# EAGLE schematic Rudder - Prototype 1 (EAGLE 7.5.0)
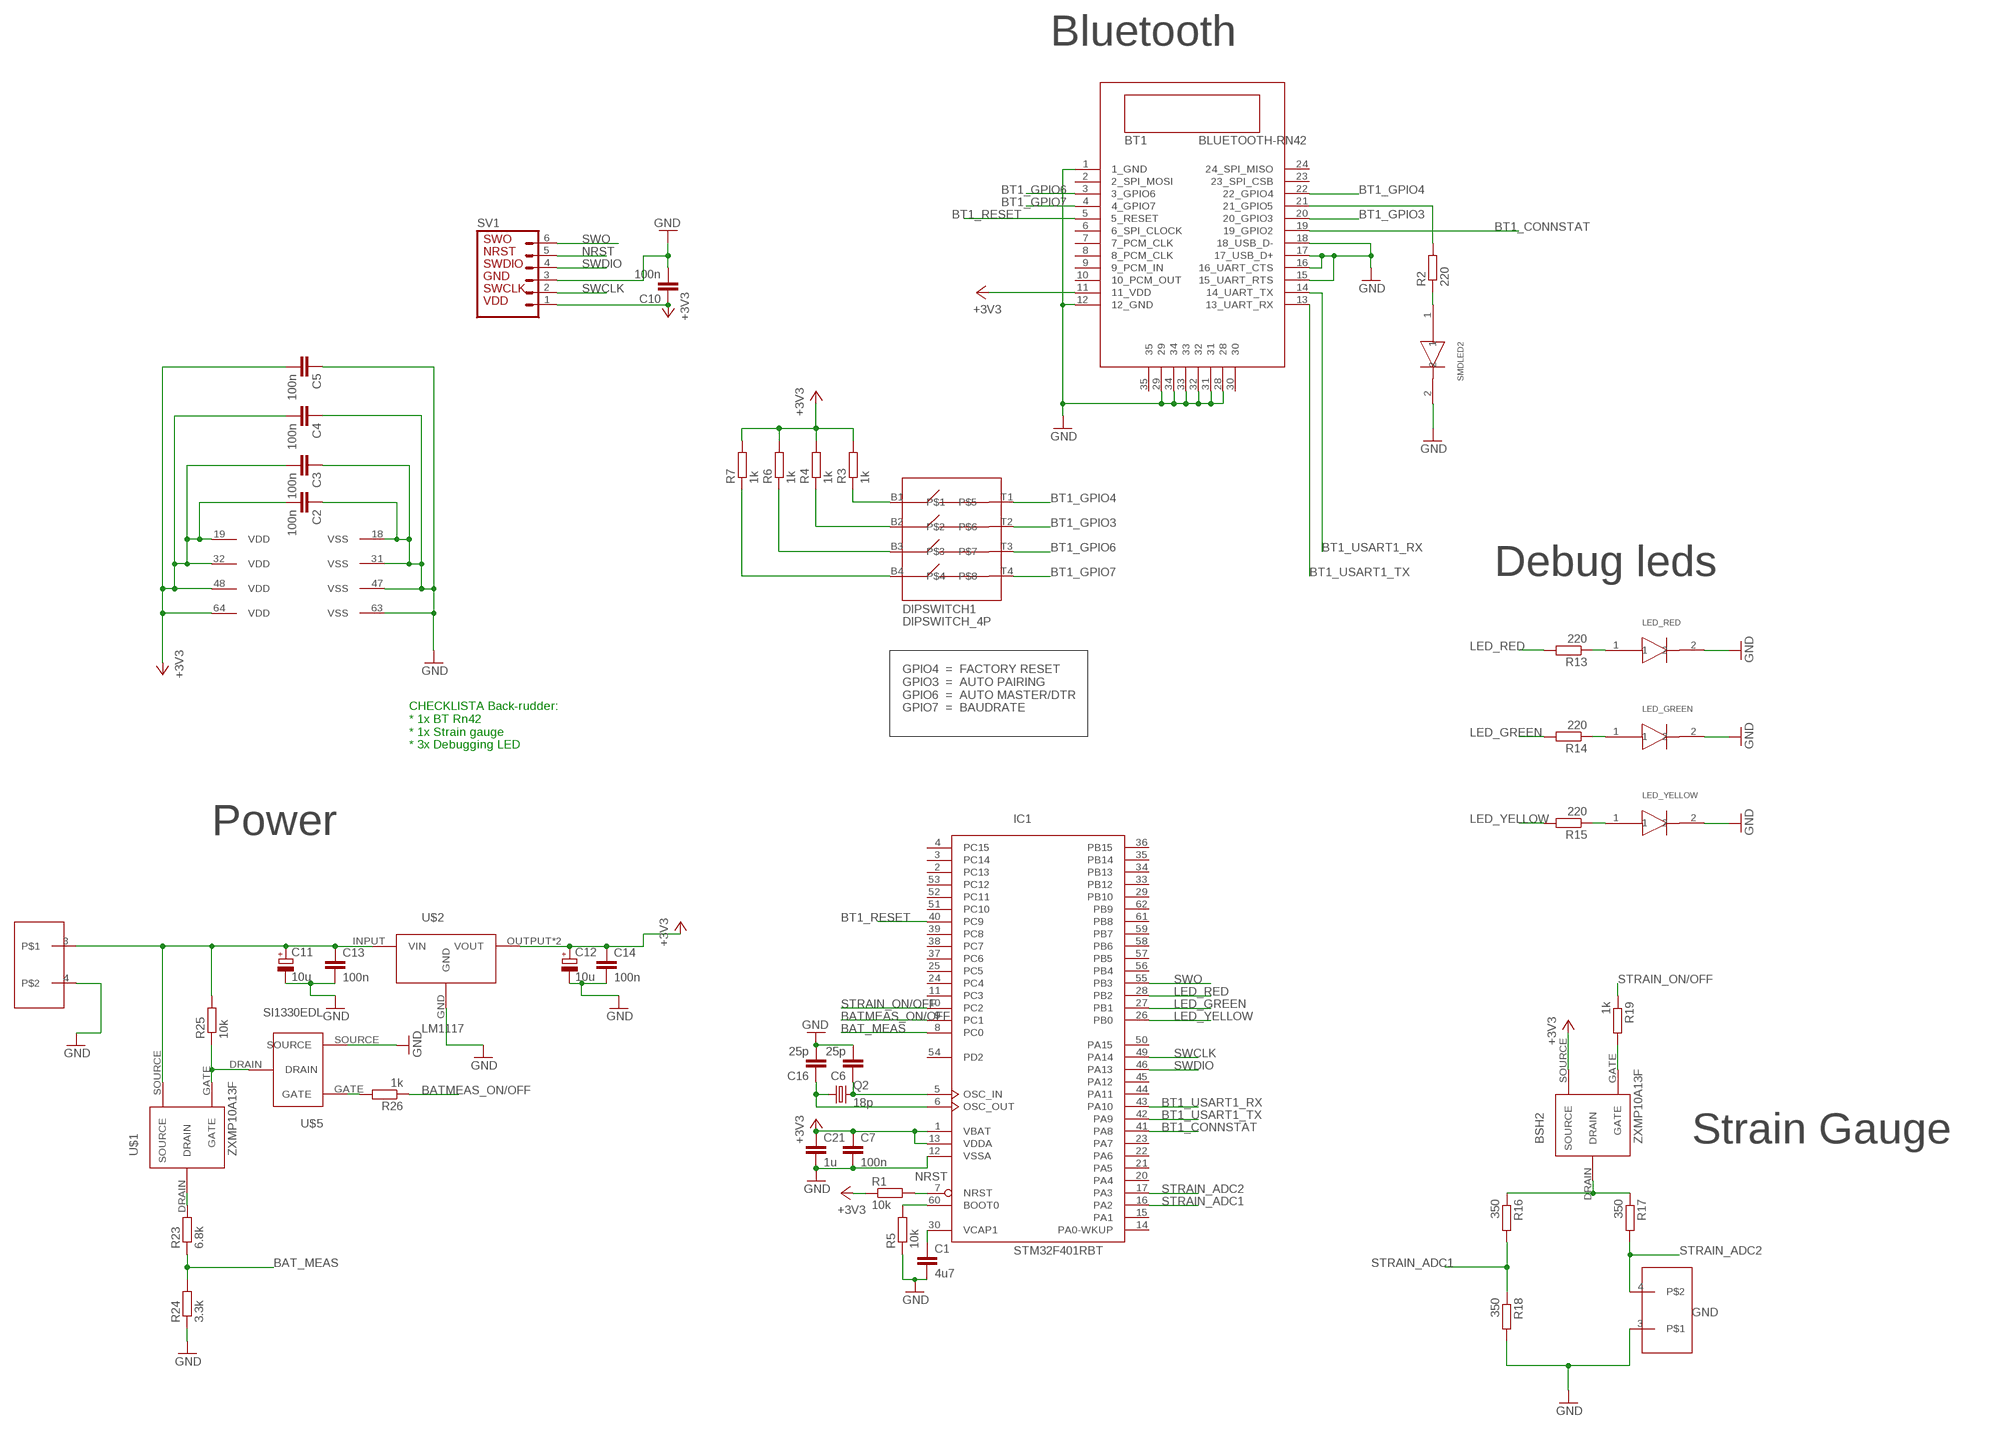
[diagram p0: schematic, sheet 1]

## Parts
BSH2  ZXMP10A13F  [P-CHANNEL]
BT1  BLUETOOTH-RN42  [RN42]
C1  4u7  C-EUC0805  [C0805]
C2  100n  C-EUC0805  [C0805]
C3  100n  C-EUC0805  [C0805]
C4  100n  C-EUC0805  [C0805]
C5  100n  C-EUC0805  [C0805]
C6  25p  C-EUC0805  [C0805]
C7  100n  C-EUC0805  [C0805]
C10  100n  C-EUC0805  [C0805]
C11  10u  CPOL-EU153CLV-0505  [153CLV-0505]
C12  10u  CPOL-EU153CLV-0505  [153CLV-0505]
C13  100n  C-EUC0805  [C0805]
C14  100n  C-EUC0805  [C0805]
C16  25p  C-EUC0805  [C0805]
C21  1u  C-EUC0805  [C0805]
DIPSWITCH1  DIPSWITCH_4P  [DIPSWITCH4P]
IC1  STM32F401RBT  [LQFP64]
LED_GREEN  SMD_LED  [SMD_LED_CUSTOM]
LED_RED  SMD_LED  [SMD_LED_CUSTOM]
LED_YELLOW  SMD_LED  [SMD_LED_CUSTOM]
Q2  18p  CRYSTALHC49UP  [HC49UP]
R1  10k  R-EU_R0805  [R0805]
R2  220  R-EU_R0805  [R0805]
R3  1k  R-EU_R0805  [R0805]
R4  1k  R-EU_R0805  [R0805]
R5  10k  R-EU_R0805  [R0805]
R6  1k  R-EU_R0805  [R0805]
R7  1k  R-EU_R0805  [R0805]
R13  220  R-EU_R0805  [R0805]
R14  220  R-EU_R0805  [R0805]
R15  220  R-EU_R0805  [R0805]
R16  350  R-EU_R0805  [R0805]
R17  350  R-EU_R0805  [R0805]
R18  350  R-EU_R0805  [R0805]
R19  1k  R-EU_R0805  [R0805]
R23  6.8k  R-EU_R0805  [R0805]
R24  3.3k  R-EU_R0805  [R0805]
R25  10k  R-EU_R0805  [R0805]
R26  1k  R-EU_R0805  [R0805]
SKRUVPLINT_2P3  SKRUVPLINT_2P  [SKRUVPLINT_2P]
SKRUVPLINT_2P5  SKRUVPLINT_2P  [SKRUVPLINT_2P]
SMDLED2  SMD_LED  [SMD_LED_CUSTOM]
SV1  MA06-1  [MA06-1]
U$1  ZXMP10A13F  [P-CHANNEL]
U$2  LM1117  [SOT-223]
U$5  SI1330EDL  [SOT-323]

## Nets
+3V3: BSH2.SOURCE BT1.11(11_VDD) C2.2 C3.2 C4.2 C5.2 C7.1 C10.1 C12.+ C14.1 C21.1 IC1.1(VBAT) IC1.13(VDDA) IC1.19(VDD) IC1.32(VDD) IC1.48(VDD) IC1.64(VDD) R1.1 R3.2 R4.2 R6.2 R7.2 SV1.1 U$2.OUTPUT(VOUT) U$2.VOUT
BAT_MEAS: IC1.8(PC0) R23.1 R24.2
BATMEAS_ON/OFF: IC1.9(PC1) R26.1
BT1_CONNSTAT: BT1.19(19_GPIO2) IC1.41(PA8)
BT1_GPIO3: BT1.20(20_GPIO3) DIPSWITCH1.T2
BT1_GPIO4: BT1.22(22_GPIO4) DIPSWITCH1.T1
BT1_GPIO6: BT1.3(3_GPIO6) DIPSWITCH1.T3
BT1_GPIO7: BT1.4(4_GPIO7) DIPSWITCH1.T4
BT1_RESET: BT1.5(5_RESET) IC1.40(PC9)
BT1_USART1_RX: BT1.14(14_UART_TX) IC1.43(PA10)
BT1_USART1_TX: BT1.13(13_UART_RX) IC1.42(PA9)
GND: BT1.1(1_GND) BT1.12(12_GND) BT1.15(15_UART_RTS) BT1.16(16_UART_CTS) BT1.17(17_USB_D+) BT1.18(18_USB_D-) BT1.28 BT1.29 BT1.31 BT1.32 BT1.33 BT1.34 C1.2 C2.1 C3.1 C4.1 C5.1 C6.2 C7.2 C10.2 C11.- C12.- C13.2 C14.2 C16.2 C21.2 IC1.12(VSSA) IC1.18(VSS) IC1.31(VSS) IC1.47(VSS) IC1.63(VSS) LED_GREEN.2 LED_RED.2 LED_YELLOW.2 R5.1 R18.2 R24.1 SKRUVPLINT_2P3.3 SKRUVPLINT_2P5.4 SMDLED2.2 SV1.3 U$2.GND U$5.SOURCE
LED_GREEN: IC1.27(PB1) R14.2
LED_RED: IC1.28(PB2) R13.2
LED_YELLOW: IC1.26(PB0) R15.2
N$1: C1.1 IC1.30(VCAP1)
N$2: IC1.60(BOOT0) R5.2
N$3: LED_RED.1 R13.1
N$4: BT1.21(21_GPIO5) R2.2
N$5: DIPSWITCH1.B1 R3.1
N$6: DIPSWITCH1.B2 R4.1
N$7: DIPSWITCH1.B3 R6.1
N$8: C6.1 IC1.5(OSC_IN) Q2.2
N$9: C16.1 IC1.6(OSC_OUT) Q2.1
N$10: DIPSWITCH1.B4 R7.1
N$11: R2.1 SMDLED2.1
N$16: LED_GREEN.1 R14.1
N$17: LED_YELLOW.1 R15.1
N$18: BSH2.DRAIN R16.1 R17.1
N$19: BSH2.GATE R19.2
N$22: C11.+ C13.1 R25.2 SKRUVPLINT_2P5.3 U$1.SOURCE U$2.INPUT(VIN)
N$25: R23.2 U$1.DRAIN
N$26: R25.1 U$1.GATE U$5.DRAIN
N$27: R26.2 U$5.GATE
NRST: IC1.7(NRST) R1.2 SV1.5
STRAIN_ADC1: IC1.16(PA2) R16.2 R18.1
STRAIN_ADC2: IC1.17(PA3) R17.2 SKRUVPLINT_2P3.4
STRAIN_ON/OFF: IC1.10(PC2) R19.1
SWCLK: IC1.49(PA14) SV1.2
SWDIO: IC1.46(PA13) SV1.4
SWO: IC1.55(PB3) SV1.6
Unconnected: BT1.2(2_SPI_MOSI) BT1.6(6_SPI_CLOCK) BT1.7(7_PCM_CLK) BT1.8(8_PCM_CLK) BT1.9(9_PCM_IN) BT1.10(10_PCM_OUT) BT1.23(23_SPI_CSB) BT1.24(24_SPI_MISO) BT1.30 BT1.35 IC1.2(PC13) IC1.3(PC14) IC1.4(PC15) IC1.11(PC3) IC1.14(PA0-WKUP) IC1.15(PA1) IC1.20(PA4) IC1.21(PA5) IC1.22(PA6) IC1.23(PA7) IC1.24(PC4) IC1.25(PC5) IC1.29(PB10) IC1.33(PB12) IC1.34(PB13) IC1.35(PB14) IC1.36(PB15) IC1.37(PC6) IC1.38(PC7) IC1.39(PC8) IC1.44(PA11) IC1.45(PA12) IC1.50(PA15) IC1.51(PC10) IC1.52(PC11) IC1.53(PC12) IC1.54(PD2) IC1.56(PB4) IC1.57(PB5) IC1.58(PB6) IC1.59(PB7) IC1.61(PB8) IC1.62(PB9)

## Notes on the sheet
- Bluetooth
- Debug leds
- GPIO4  =  FACTORY RESET
  GPIO3  =  AUTO PAIRING
  GPIO6  =  AUTO MASTER/DTR
  GPIO7  =  BAUDRATE
- CHECKLISTA Back-rudder:
  * 1x BT Rn42
  * 1x Strain gauge
  * 3x Debugging LED
- Power
- Strain Gauge

## Library data of the parts
BSH2 U$1 = ZXMP10A13F:ZXMP10A13F
BT1 = RN42:BLUETOOTH-RN42
C1-C7 C10 C13 C14 C16 C21 = rcl:C-EU: CAPACITOR, European symbol
C11 C12 = rcl:CPOL-EU: POLARIZED CAPACITOR, European symbol
DIPSWITCH1 = dipswitch4p:DIPSWITCH_4P
IC1 = E7020E:STM32F401R*T: ARM 32-bit Cortex™-M3 CPU 84 MHz maximum frequency 128 to 256 Kbytes of Flash memory 64 kbytes of SRAM 50 GPIOs 1.7 to 3.6 V application supply
LED_GREEN LED_RED LED_YELLOW SMDLED2 = greenled_smd:SMD_LED
Q2 = crystal:CRYSTAL: CRYSTAL; OC_FARNELL: unknown; OC_NEWARK: unknown
R1 R5 R16-R19 R23-R26 = rcl:R-EU_: RESISTOR, European symbol
R2-R4 R6 R7 R13-R15 = resistor:R-EU_: RESISTOR, European symbol
SKRUVPLINT_2P3 SKRUVPLINT_2P5 = skruvplint2p_CTB0700:SKRUVPLINT_2P
SV1 = E7020E:MA06-1: PIN HEADER; OC_FARNELL: unknown; OC_NEWARK: unknown
U$2 = LM1117:LM1117
U$5 = SI1330EDL:SI1330EDL